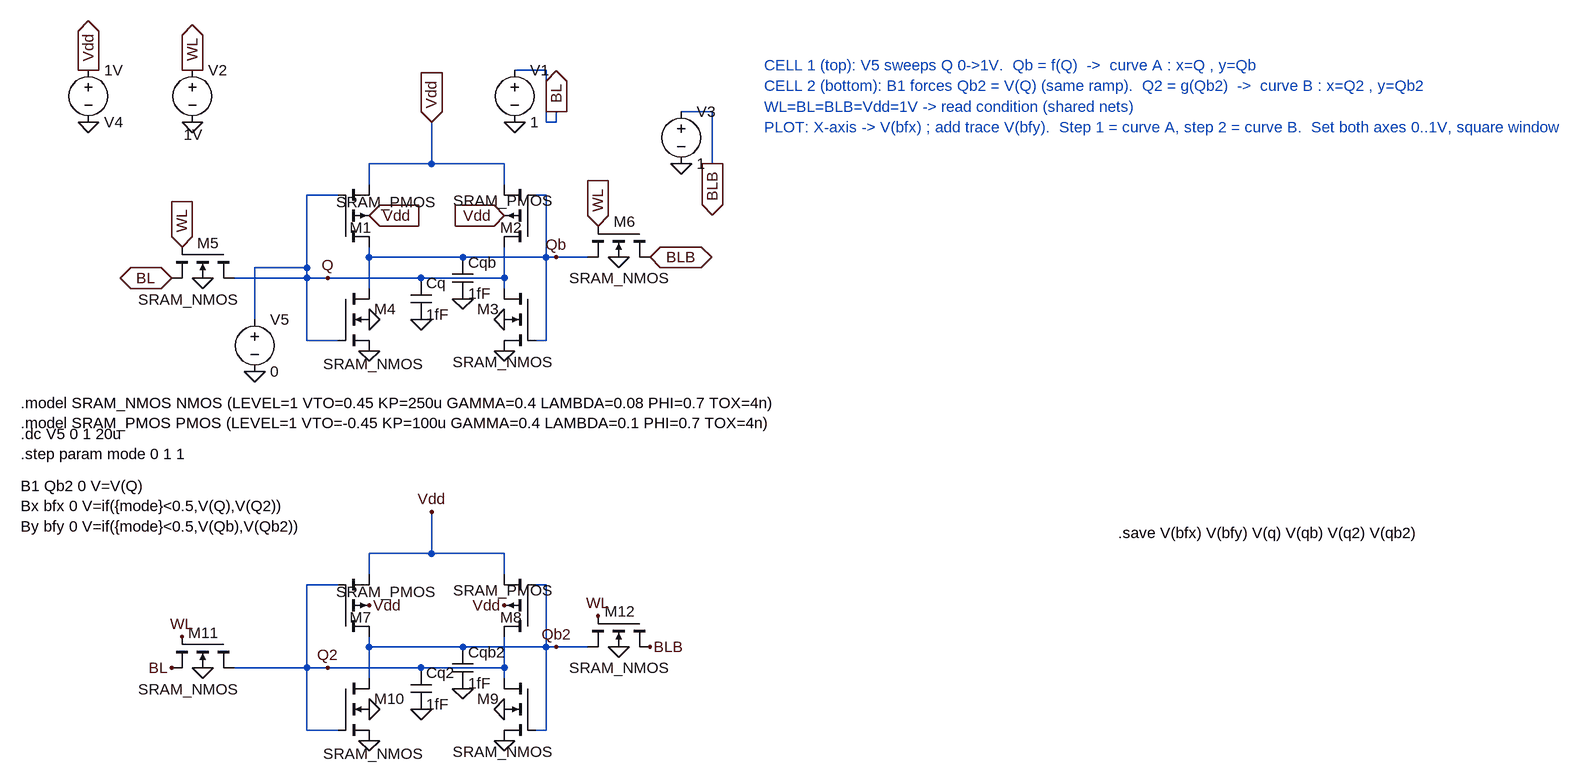
[diagram p0: schematic SRAM_6T_butterfly_SNM_v4.asc]
SRAM_6T_butterfly_SNM_v4.asc, the LTspice schematic file:
Version 4.1
SHEET 1 1800 1200
WIRE 384 -96 336 -96
WIRE 640 -32 592 -32
WIRE 384 -16 384 -96
WIRE 400 -16 400 -32
WIRE 400 -16 384 -16
WIRE 208 48 208 -16
WIRE 208 48 112 48
WIRE 320 48 208 48
WIRE 640 48 640 -32
WIRE 112 80 112 48
WIRE 320 80 320 48
WIRE 64 96 16 96
WIRE 384 96 368 96
WIRE 112 192 112 176
WIRE 256 192 112 192
WIRE 384 192 384 96
WIRE 384 192 256 192
WIRE 400 192 384 192
WIRE 448 192 400 192
WIRE 16 208 16 96
WIRE 16 208 -64 208
WIRE 16 224 16 208
WIRE 16 224 -96 224
WIRE 48 224 16 224
WIRE 192 224 48 224
WIRE 320 224 320 176
WIRE 320 224 192 224
WIRE 112 240 112 192
WIRE 320 240 320 224
WIRE -64 288 -64 208
WIRE 16 320 16 224
WIRE 64 320 16 320
WIRE 384 320 384 192
WIRE 384 320 368 320
WIRE 208 648 208 584
WIRE 208 648 112 648
WIRE 320 648 208 648
WIRE 112 680 112 648
WIRE 320 680 320 648
WIRE 64 696 16 696
WIRE 384 696 368 696
WIRE 112 792 112 776
WIRE 256 792 112 792
WIRE 384 792 384 696
WIRE 384 792 256 792
WIRE 400 792 384 792
WIRE 448 792 400 792
WIRE 16 824 16 696
WIRE 16 824 -96 824
WIRE 48 824 16 824
WIRE 192 824 48 824
WIRE 320 824 320 776
WIRE 320 824 192 824
WIRE 112 840 112 792
WIRE 320 840 320 824
WIRE 16 920 16 824
WIRE 64 920 16 920
WIRE 384 920 384 792
WIRE 384 920 368 920
FLAG 112 336 0
FLAG 320 336 0
FLAG 544 192 BLB
IOPIN 544 192 BiDir
FLAG -192 224 BL
IOPIN -192 224 BiDir
FLAG 464 144 WL
IOPIN 464 144 In
FLAG -176 176 WL
IOPIN -176 176 In
FLAG -160 -16 0
FLAG -160 -96 WL
IOPIN -160 -96 Out
FLAG 320 288 0
FLAG 112 288 0
FLAG -144 224 0
FLAG 496 192 0
FLAG 112 128 Vdd
IOPIN 112 128 In
FLAG 320 128 Vdd
IOPIN 320 128 In
FLAG -320 -16 0
FLAG -320 -96 Vdd
IOPIN -320 -96 Out
FLAG 208 -16 Vdd
IOPIN 208 -16 In
FLAG 48 224 Q
FLAG 400 192 Qb
FLAG 192 288 0
FLAG 256 256 0
FLAG 400 -32 BL
IOPIN 400 -32 Out
FLAG 640 48 BLB
IOPIN 640 48 Out
FLAG 336 -16 0
FLAG 592 48 0
FLAG -64 368 0
FLAG 112 936 0
FLAG 320 936 0
FLAG 544 792 BLB
FLAG -192 824 BL
FLAG 464 744 WL
FLAG -176 776 WL
FLAG 320 888 0
FLAG 112 888 0
FLAG -144 824 0
FLAG 496 792 0
FLAG 112 728 Vdd
FLAG 320 728 Vdd
FLAG 208 584 Vdd
FLAG 48 824 Q2
FLAG 400 792 Qb2
FLAG 192 888 0
FLAG 256 856 0
SYMBOL pmos4 64 176 M180
WINDOW 0 18 30 Left 2
WINDOW 3 -3 69 Left 2
SYMATTR InstName M1
SYMATTR Value SRAM_PMOS
SYMATTR Value2 l=180nm w=360nm
SYMBOL pmos4 368 176 R180
WINDOW 0 21 30 Left 2
WINDOW 3 -26 71 Left 2
SYMATTR InstName M2
SYMATTR Value SRAM_PMOS
SYMATTR Value2 l=180nm w=360nm
SYMBOL nmos4 368 240 M0
WINDOW 3 -27 113 Left 2
SYMATTR Value SRAM_NMOS
SYMATTR InstName M3
SYMATTR Value2 l=180nm w=720nm
SYMBOL nmos4 64 240 R0
WINDOW 3 -23 116 Left 2
SYMATTR Value SRAM_NMOS
SYMATTR InstName M4
SYMATTR Value2 l=180nm w=720nm
SYMBOL voltage -320 -112 R0
WINDOW 0 24 96 Left 2
WINDOW 3 24 16 Left 2
WINDOW 123 0 0 Left 0
WINDOW 39 0 0 Left 0
SYMATTR InstName V4
SYMATTR Value 1V
SYMBOL nmos4 -96 176 R90
WINDOW 0 -6 23 VRight 2
WINDOW 3 81 -7 VRight 2
SYMATTR InstName M5
SYMATTR Value SRAM_NMOS
SYMATTR Value2 l=180nm w=540nm
SYMBOL nmos4 544 144 R90
WINDOW 0 -7 22 VRight 2
WINDOW 3 80 -30 VRight 2
SYMATTR InstName M6
SYMATTR Value SRAM_NMOS
SYMATTR Value2 l=180nm w=540nm
SYMBOL voltage -160 -112 R0
WINDOW 123 0 0 Left 0
WINDOW 39 0 0 Left 0
WINDOW 3 -13 115 Left 2
SYMATTR Value 1V
SYMATTR InstName V2
SYMBOL cap 176 224 R0
SYMATTR InstName Cq
SYMATTR Value 1fF
SYMBOL cap 240 192 R0
SYMATTR InstName Cqb
SYMATTR Value 1fF
SYMBOL voltage 336 -112 R0
WINDOW 123 0 0 Left 0
WINDOW 39 0 0 Left 0
SYMATTR InstName V1
SYMATTR Value 1
SYMBOL voltage 592 -48 R0
WINDOW 123 0 0 Left 0
WINDOW 39 0 0 Left 0
SYMATTR InstName V3
SYMATTR Value 1
SYMBOL voltage -64 272 R0
WINDOW 123 0 0 Left 0
WINDOW 39 0 0 Left 0
SYMATTR InstName V5
SYMATTR Value 0
SYMBOL pmos4 64 776 M180
WINDOW 0 18 30 Left 2
WINDOW 3 -3 69 Left 2
SYMATTR InstName M7
SYMATTR Value SRAM_PMOS
SYMATTR Value2 l=180nm w=360nm
SYMBOL pmos4 368 776 R180
WINDOW 0 21 30 Left 2
WINDOW 3 -26 71 Left 2
SYMATTR InstName M8
SYMATTR Value SRAM_PMOS
SYMATTR Value2 l=180nm w=360nm
SYMBOL nmos4 368 840 M0
WINDOW 3 -27 113 Left 2
SYMATTR Value SRAM_NMOS
SYMATTR InstName M9
SYMATTR Value2 l=180nm w=720nm
SYMBOL nmos4 64 840 R0
WINDOW 3 -23 116 Left 2
SYMATTR Value SRAM_NMOS
SYMATTR InstName M10
SYMATTR Value2 l=180nm w=720nm
SYMBOL nmos4 -96 776 R90
WINDOW 0 -6 23 VRight 2
WINDOW 3 81 -7 VRight 2
SYMATTR InstName M11
SYMATTR Value SRAM_NMOS
SYMATTR Value2 l=180nm w=540nm
SYMBOL nmos4 544 744 R90
WINDOW 0 -7 22 VRight 2
WINDOW 3 80 -30 VRight 2
SYMATTR InstName M12
SYMATTR Value SRAM_NMOS
SYMATTR Value2 l=180nm w=540nm
SYMBOL cap 176 824 R0
SYMATTR InstName Cq2
SYMATTR Value 1fF
SYMBOL cap 240 792 R0
SYMATTR InstName Cqb2
SYMATTR Value 1fF
TEXT -424 416 Left 2 !.model SRAM_NMOS NMOS (LEVEL=1 VTO=0.45 KP=250u GAMMA=0.4 LAMBDA=0.08 PHI=0.7 TOX=4n)\n.model SRAM_PMOS PMOS (LEVEL=1 VTO=-0.45 KP=100u GAMMA=0.4 LAMBDA=0.1 PHI=0.7 TOX=4n)
TEXT -424 464 Left 2 !.dc V5 0 1 20u\n.step param mode 0 1 1
TEXT -424 544 Left 2 !B1 Qb2 0 V=V(Q)\nBx bfx 0 V=if({mode}<0.5,V(Q),V(Q2))\nBy bfy 0 V=if({mode}<0.5,V(Qb),V(Qb2))
TEXT 720 -104 Left 2 ;CELL 1 (top): V5 sweeps Q 0->1V.  Qb = f(Q)  ->  curve A : x=Q , y=Qb
TEXT 720 -72 Left 2 ;CELL 2 (bottom): B1 forces Qb2 = V(Q) (same ramp).  Q2 = g(Qb2)  ->  curve B : x=Q2 , y=Qb2
TEXT 720 -40 Left 2 ;WL=BL=BLB=Vdd=1V -> read condition (shared nets)
TEXT 720 -8 Left 2 ;PLOT: X-axis -> V(bfx) ; add trace V(bfy).  Step 1 = curve A, step 2 = curve B.  Set both axes 0..1V, square window
TEXT 1264 616 Left 2 !.save V(bfx) V(bfy) V(q) V(qb) V(q2) V(qb2)

The netlist it stands for:
* SRAM_6T_butterfly_SNM_v4.asc
M1 Qb Q Vdd Vdd SRAM_PMOS l=180nm w=360nm
M2 Q Qb Vdd Vdd SRAM_PMOS l=180nm w=360nm
M3 Q Qb 0 0 SRAM_NMOS l=180nm w=720nm
M4 Qb Q 0 0 SRAM_NMOS l=180nm w=720nm
V4 Vdd 0 1V
M5 Q WL BL 0 SRAM_NMOS l=180nm w=540nm
M6 BLB WL Qb 0 SRAM_NMOS l=180nm w=540nm
V2 WL 0 1V
Cq Q 0 1fF
Cqb Qb 0 1fF
V1 BL 0 1
V3 BLB 0 1
V5 Q 0 0
M7 Qb2 Q2 Vdd Vdd SRAM_PMOS l=180nm w=360nm
M8 Q2 Qb2 Vdd Vdd SRAM_PMOS l=180nm w=360nm
M9 Q2 Qb2 0 0 SRAM_NMOS l=180nm w=720nm
M10 Qb2 Q2 0 0 SRAM_NMOS l=180nm w=720nm
M11 Q2 WL BL 0 SRAM_NMOS l=180nm w=540nm
M12 BLB WL Qb2 0 SRAM_NMOS l=180nm w=540nm
Cq2 Q2 0 1fF
Cqb2 Qb2 0 1fF
.model NMOS NMOS
.model PMOS PMOS
.lib standard.mos
.model SRAM_NMOS NMOS (LEVEL=1 VTO=0.45 KP=250u GAMMA=0.4 LAMBDA=0.08 PHI=0.7 TOX=4n)
.model SRAM_PMOS PMOS (LEVEL=1 VTO=-0.45 KP=100u GAMMA=0.4 LAMBDA=0.1 PHI=0.7 TOX=4n)
.dc V5 0 1 20u
.step param mode 0 1 1
B1 Qb2 0 V=V(Q)
Bx bfx 0 V=if({mode}<0.5,V(Q),V(Q2))
By bfy 0 V=if({mode}<0.5,V(Qb),V(Qb2))
* CELL 1 (top): V5 sweeps Q 0->1V.  Qb = f(Q)  ->  curve A : x=Q , y=Qb
* CELL 2 (bottom): B1 forces Qb2 = V(Q) (same ramp).  Q2 = g(Qb2)  ->  curve B : x=Q2 , y=Qb2
* WL=BL=BLB=Vdd=1V -> read condition (shared nets)
* PLOT: X-axis -> V(bfx) ; add trace V(bfy).  Step 1 = curve A, step 2 = curve B.  Set both axes 0..1V, square window
.save V(bfx) V(bfy) V(q) V(qb) V(q2) V(qb2)
.backanno
.end